# Altium schematic sheet Sheet1.SCHDOC
size 420 x 297 mm; SheetNumber: 2; SheetTotal: 2; DocumentName: Sheet1.SCHDOC
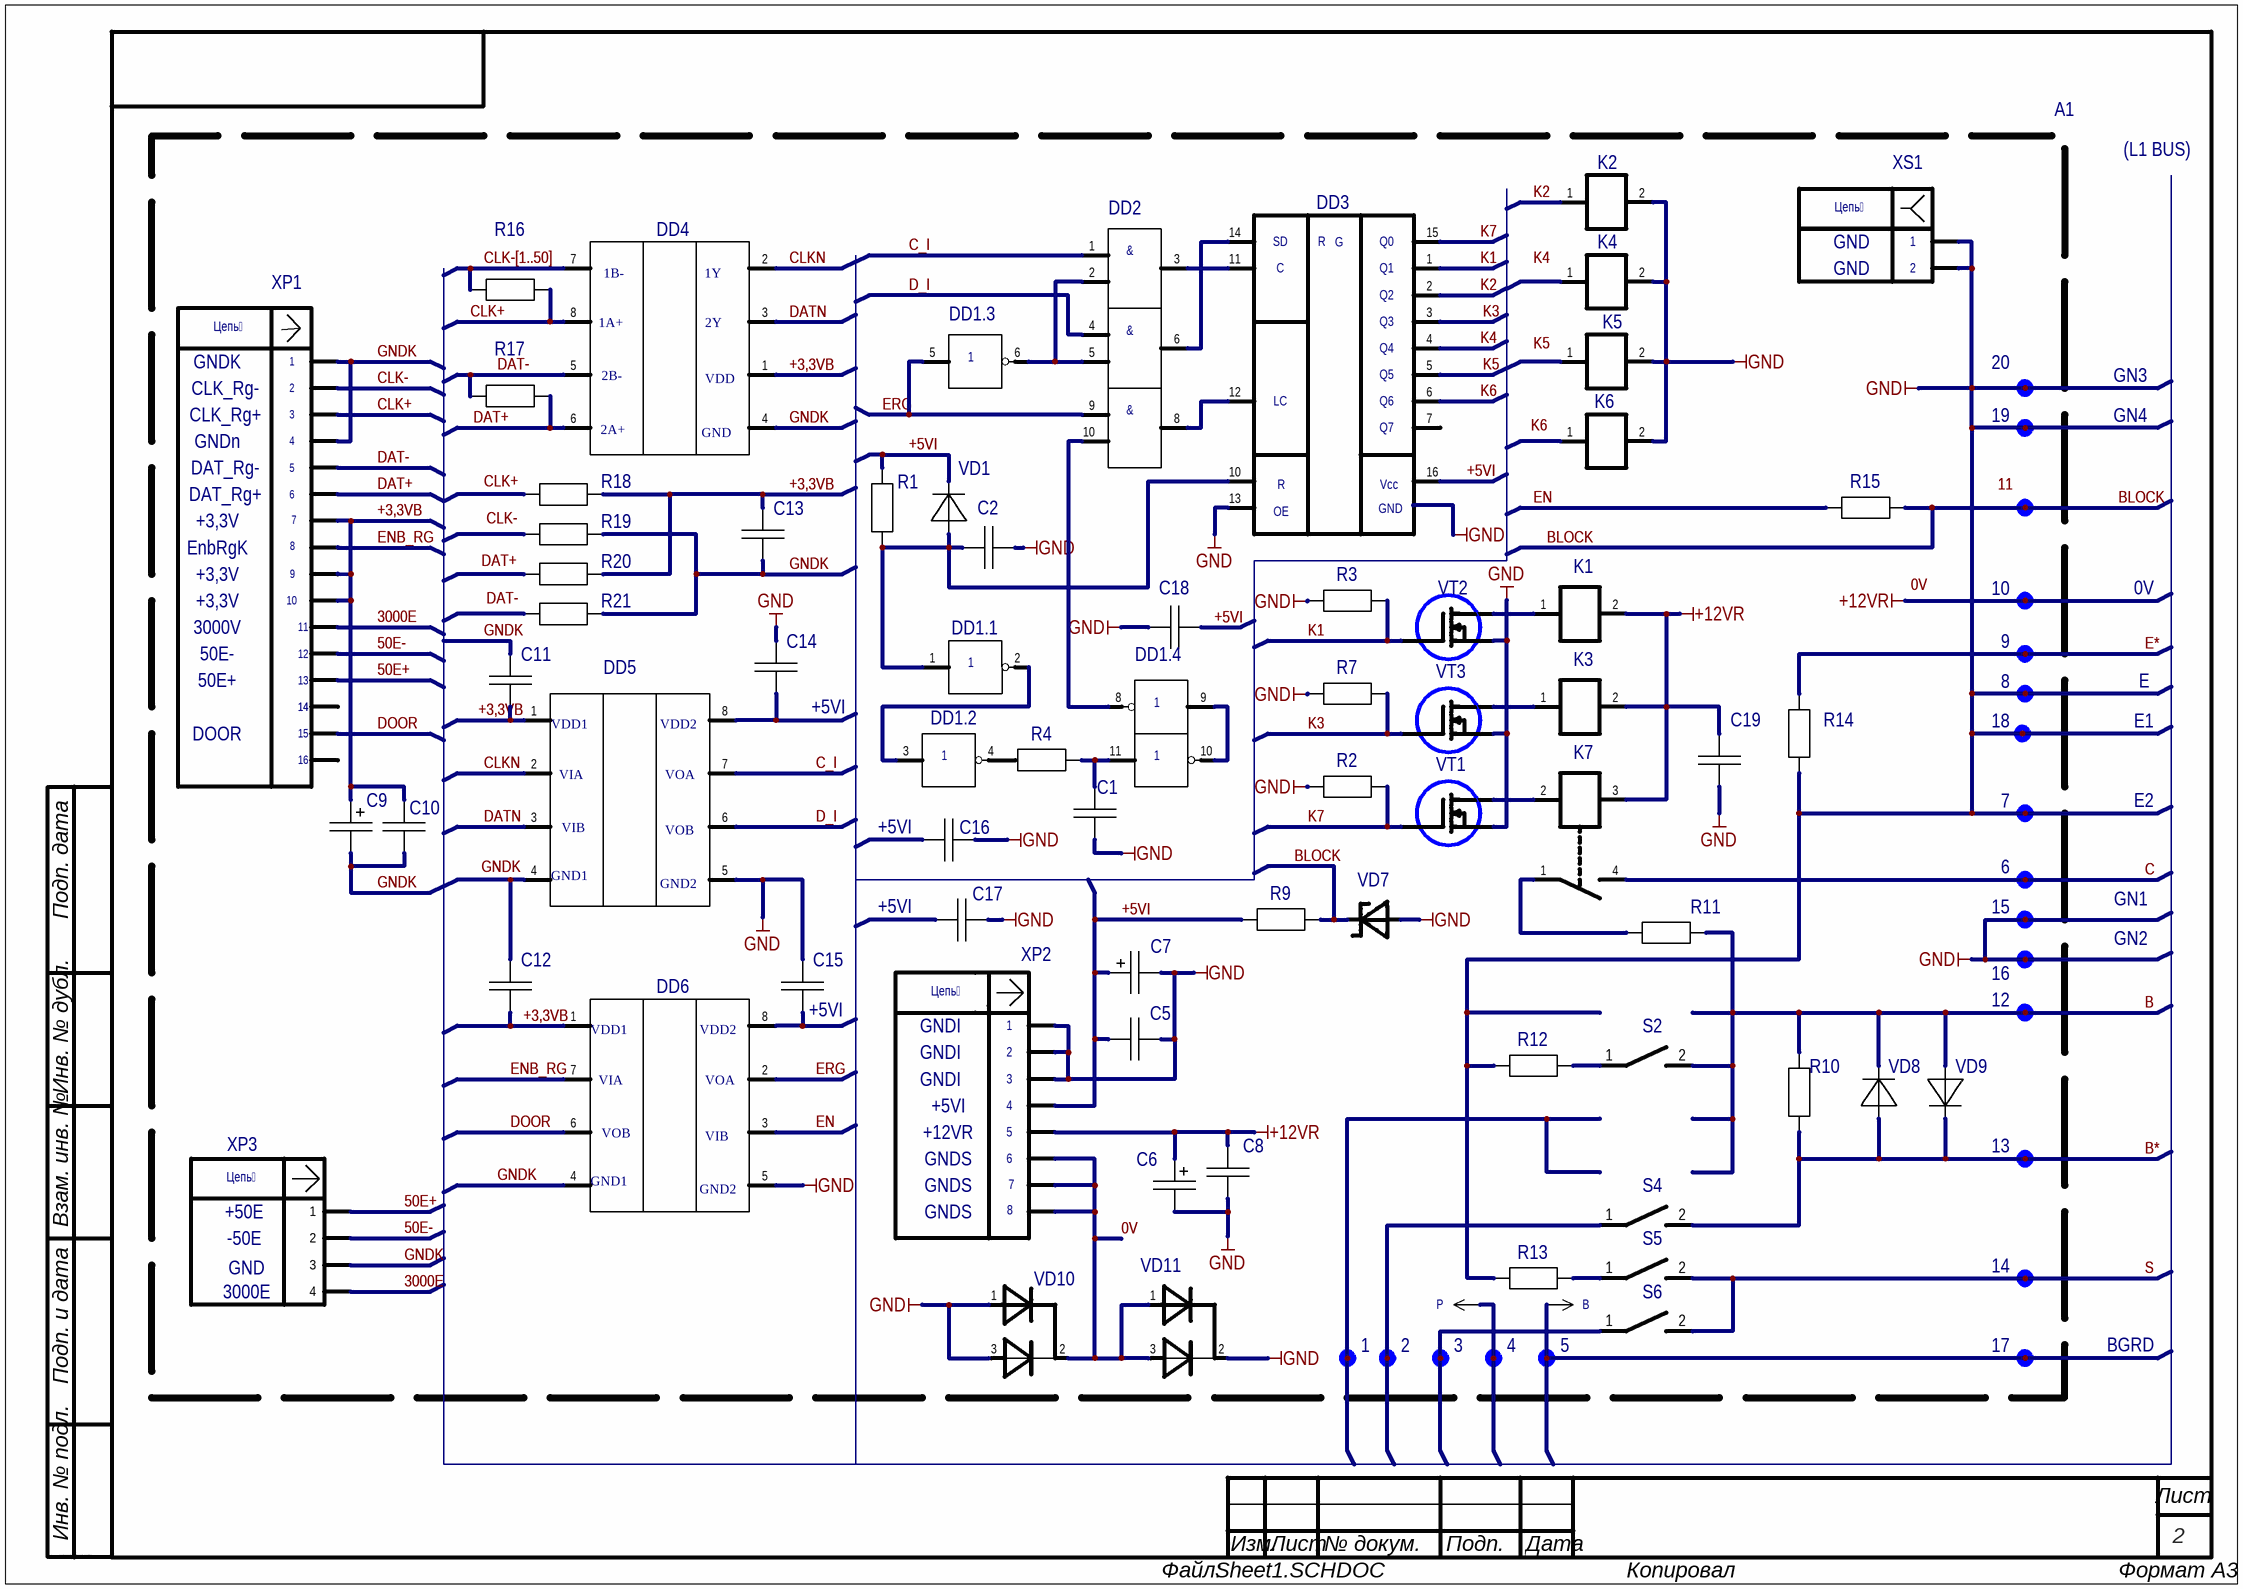
[diagram p0: Sheet1.SCHDOC]

## Parts
1  ТОЧКА ПАЙКИ 1  [LEPESTOK7_750_224]  (value not drawn)
2  ТОЧКА ПАЙКИ 1  [LEPESTOK7_750_224]  (value not drawn)
3  ТОЧКА ПАЙКИ 1  [LEPESTOK7_750_224]  (value not drawn)
4  ТОЧКА ПАЙКИ 1  [LEPESTOK7_750_224]  (value not drawn)
5  ТОЧКА ПАЙКИ 1  [LEPESTOK7_750_224]  (value not drawn)
6  ТОЧКА ПАЙКИ 1  [LEPESTOK7_750_224]  (value not drawn)
7  ТОЧКА ПАЙКИ 1  [LEPESTOK7_750_224]  (value not drawn)
8  ТОЧКА ПАЙКИ 1  [LEPESTOK7_750_224]  (value not drawn)
9  ТОЧКА ПАЙКИ 1  [LEPESTOK7_750_224]  (value not drawn)
10  ТОЧКА ПАЙКИ 1  [LEPESTOK7_750_224]  (value not drawn)
11  ТОЧКА ПАЙКИ 1  [LEPESTOK7_750_224]  (value not drawn)
12  ТОЧКА ПАЙКИ 1  [LEPESTOK7_750_224]  (value not drawn)
13  ТОЧКА ПАЙКИ 1  [LEPESTOK7_750_224]  (value not drawn)
14  ТОЧКА ПАЙКИ 1  [LEPESTOK7_750_224]  (value not drawn)
15  ТОЧКА ПАЙКИ 1  [LEPESTOK7_750_224]  (value not drawn)
16  ТОЧКА ПАЙКИ 1  [LEPESTOK7_750_224]  (value not drawn)
17  ТОЧКА ПАЙКИ 1  [LEPESTOK7_750_224]  (value not drawn)
18  ТОЧКА ПАЙКИ 1  [LEPESTOK7_750_224]  (value not drawn)
19  ТОЧКА ПАЙКИ 1  [LEPESTOK7_750_224]  (value not drawn)
20  ТОЧКА ПАЙКИ 1  [LEPESTOK7_750_224]  (value not drawn)
C1  0805-2F3-0,33 МКФ  [0805]  (value not drawn)
C2  0805-2F3-0,33 МКФ  [0805]  (value not drawn)
C5  0805-2F3-0,33 МКФ  [0805]  (value not drawn)
C6  TAJB685K16RNJ  [TANT_B]  (value not drawn)
C7  TAJB685K16RNJ  [TANT_B]  (value not drawn)
C8  0805-2F3-0,33 МКФ  [0805]  (value not drawn)
C9  TAJB685K16RNJ  [TANT_B]  (value not drawn)
C10  0805-2F3-0,1 МКФ  [0805]  (value not drawn)
C11  0805-2F3-0,1 МКФ  [0805]  (value not drawn)
C12  0805-2F3-0,1 МКФ  [0805]  (value not drawn)
C13  0805-2F3-0,1 МКФ  [0805]  (value not drawn)
C14  0805-2F3-0,1 МКФ  [0805]  (value not drawn)
C15  0805-2F3-0,1 МКФ  [0805]  (value not drawn)
C16  0805-2F3-0,33 МКФ  [0805]  (value not drawn)
C17  0805-2F3-0,33 МКФ  [0805]  (value not drawn)
C18  0805-2F3-0,33 МКФ  [0805]  (value not drawn)
C19  0805-2F3-0,33 МКФ  [0805]  (value not drawn)
DD1.1  IN74HC04-1A  (value not drawn)
DD1.2  IN74HC04  [SO-14]  (value not drawn)  (part B of 6)
DD3  IN74HC595AD-A  (value not drawn)
DD4  SN65LVDS34  (value not drawn)
DD5  ADUM1200AR  (value not drawn)
DD6  ADUM1201AR-C  (value not drawn)
DD7  IN74HC08D  [SO-14]  (value not drawn)  (part C of 4)
DD10  IN74HC08D  [SO-14]  (value not drawn)  (part B of 4)
K1  КАТУШКА УШЯИ.685442.092  (value not drawn)
K2  КАТУШКА УШЯИ.685442.086  (value not drawn)
K3  КАТУШКА УШЯИ.685442.092  (value not drawn)
K4  КАТУШКА УШЯИ.685442.086  (value not drawn)
K5  КАТУШКА УШЯИ.685442.086  (value not drawn)
K6  КАТУШКА УШЯИ.685442.086  (value not drawn)
K7  РЕЛЕ DAT71210  (value not drawn)
R1  0805-51 KОМ+-5%  [0805]  (value not drawn)
R2  0805-1 KОМ+-5%  [0805]  (value not drawn)
R3  0805-1 KОМ+-5%  [0805]  (value not drawn)
R4  0805-51 KОМ+-5%  [0805]  (value not drawn)
R7  0805-1 KОМ+-5%  [0805]  (value not drawn)
R9  1206-22 ОМ+-5%  [1206]  (value not drawn)
R10  С2-33Н-0,25-22 ОМ+-5%-А-Г-В  [C2-33-0,25]  (value not drawn)
R11  С2-33Н-0,5-1 ОМ+-5%-А-Г-В  [C2-33-0,5]  (value not drawn)
R12  С2-33Н-1-1 КОМ+-5%-А-Г-В  [C2-33-1]  (value not drawn)
R13  С2-33Н-0,5-10 ОМ+-5%-А-Г-В  [C2-33-0,5]  (value not drawn)
R14  С2-33Н-0,25-22 ОМ+-5%-А-Г-В  [C2-33-0,25]  (value not drawn)
R15  0805-1 KОМ+-5%  [0805]  (value not drawn)
R16  0805-100 ОМ+-5%  [0805]  (value not drawn)
R17  0805-100 ОМ+-5%  [0805]  (value not drawn)
R18  0805-100 ОМ+-5%  [0805]  (value not drawn)
R19  0805-100 ОМ+-5%  [0805]  (value not drawn)
R20  0805-100 ОМ+-5%  [0805]  (value not drawn)
R21  0805-100 ОМ+-5%  [0805]  (value not drawn)
S2  ГЕРКОН МКА-14103А  (value not drawn)
S4  ГЕРКОН МКА-14103А  (value not drawn)
S5  ГЕРКОН МКА-14103А  (value not drawn)
S6  ГЕРКОН МКА-14103А  (value not drawn)
U1  P
U2  B
U4  IN74HC04-3  (value not drawn)
U5  IN74HC04-4  (value not drawn)
U6  IN74HC08D-1A  (value not drawn)
U7  IN74HC04-6  (value not drawn)
VD1  ДИОД FR307  (value not drawn)
VD7  СУПРЕССОР 1.5KE6.8A  (value not drawn)
VD8  ДИОД FR307  (value not drawn)
VD9  ДИОД FR307  (value not drawn)
VD10  ДИОД VS-43CTQ100  (value not drawn)
VD11  ДИОД VS-43CTQ100  (value not drawn)
VT1  NDS7002A  [SOT-23]  (value not drawn)
VT2  NDS7002A  [SOT-23]  (value not drawn)
VT3  NDS7002A  [SOT-23]  (value not drawn)
XP2  BH-16  [BH-16]  (value not drawn)
XP3  AMP 0-0280371-1  (value not drawn)
XP4  AMPMODU-II 280373-2  (value not drawn)
XS23  РОЗЕТКА  XT-60-F  (value not drawn)

## Nets
+12VR: 10.1 C6.1 C8.2 C19.1 K1.2 K3.2 K7.3 XP4.5
GND: 7.1 8.1 15.1 16.1 18.1 19.1 20.1 C1.2 C2.1 C5.1 C6.2 C7.2 C8.1 C14.2 C15.2 C16.2 C17.2 C18.2 C19.2 DD3.13 DD5.5 DD6.5 K2.2 K4.2 K5.2 K6.2 R2.1 R3.1 R7.1 R12.1 R13.1 R14.1(A) VD7.2(+) VD10.1 VD10.3 VD11.2 VT1.E VT2.E VT3.E XP4.1 XP4.2 XP4.3 XS23.1 XS23.2
0V: VD10.2 VD11.1 VD11.3 XP4.6 XP4.7 XP4.8
50E+: XP2.13 XP3.1
50E-: XP2.12 XP3.2
3000E: XP2.11 XP3.4
+3,3VB: C9.1 C10.2 C11.1 C12.1 C13.2 DD4.1 DD5.1 DD6.1 R18.2 R20.2 XP2.7 XP2.9 XP2.10
+5VI: C5.2 C7.1 C18.1 DD3.16 R1.2 R9.2 VD1.2 XP4.4
B: 12.1 R10.2(A) R11.1 S2.2 VD8.2 VD9.1
B*: 13.1 R10.1(A) S4.2 VD8.1 VD9.2
BLOCK: 11.1 R9.1 R15.2 VD7.1(-)
C: 6.1 K7.4
C_I: DD5.7 U6.1
CLK+: DD4.8 R16.2 XP2.3
CLK-: XP2.2
CLK-[1..50]: DD4.7 R16.1
CLKN: DD4.2 DD5.2
D_I: DD5.6 DD10.4
DAT+: DD4.6 R17.2 XP2.6
DAT-: DD4.5 R17.1 XP2.5
DATN: DD4.3 DD5.3
DOOR: DD6.6 XP2.15
E*: 9.1 R14.2(A)
EN: DD6.3 R15.1
ENB_RG: DD6.7 XP2.8
ERG: DD6.2 DD7.9 U7.5
GNDK: C9.2 C10.1 C11.2 C13.1 DD4.4 DD6.4 R19.2 R21.2 XP2.1 XP2.4 XP3.3
K1: DD3.1(Q1) R3.2 VT2.B
K2: DD3.2(Q2) K2.1
K3: DD3.3(Q4) R7.2 VT3.B
K4: DD3.4(Q4)
K5: DD3.5(Q5)
K6: DD3.6(Q6)
K7: DD3.15(Q0) R2.2 VT1.B
S: 14.1 S5.2 S6.2
Net2_1: 2.1 S4.1
Net3_1: 3.1 S6.1
Net4_1: 4.1 U1.1
Net5_1: 5.1 17.1 U2.1
NetC1_1: C1.1 R4.1 U5.11
NetC2_2: C2.2 DD1.1.1 DD3.10 R1.1 VD1.1
NetC12_2: C12.2 DD5.4
NetC14_1: C14.1 DD5.8
NetC15_1: C15.1 DD6.8
NetDD1.1_2: DD1.1.2 DD1.2.3
NetDD1.2_4: DD1.2.4 R4.2
NetDD3_11: DD3.11(C) U6.3
NetDD3_12: DD3.12(LC) DD7.8
NetDD3_14: DD3.14(SD) DD10.6
NetDD7_10: DD7.10 U4.8
NetDD10_5: DD10.5 U6.2 U7.6
NetK1_1: K1.1 VT2.K
NetK3_1: K3.1 VT3.K
NetK7_1: K7.1 R11.2
NetK7_2: K7.2 VT1.K
NetR12_2: R12.2 S2.1
NetR13_2: R13.2 S5.1
NetU4_9: U4.9 U5.10

Not connected (* = marked no-connect by the designer): 1 1; C16 1; C17 1; DD3 7(Q7); K4 1; K5 1; K6 1; R18 1; R19 1; R20 1; R21 1; XP2 14 16

## Notes on the sheet
- A1
- XS1
- (L1 BUS)
- (near U6) DD2
- GND
- XP1
- (near U7) DD1.3
- GNDK
- (near XP2) CLK_Rg-
- GN3
- GNDn
- (near XP2) DAT_Rg-
- (near XP2) CLK_Rg+
- GN4
- +3,3V
- (near XP2) DAT_Rg+
- EnbRgK
- 0V
- 3000V
- 50E-
- (near C18) DD1.4
- 50E+
- DOOR
- (near C14) +5VI
- DD1.2
- E
- E1
- (near C16) +5VI
- E2
- (near C17) +5VI
- GN1
- (near C15) +5VI
- XP2
- GN2
- GNDI
- +5VI
- (near XP4) +12VR
- +50E
- GNDS
- -50E
- (near XP3) 3000E
- BGRD
- Подп. дата
- Инв. № дубл.
- Взам. инв. №
- Подп. и дата
- Инв. № подл.
- Изм.
- Лист
- № докум.
- Подп.
- Дата
- ALTIUM GOSTBOM2.0 KEV
- Файл:
- Копировал
- Формат А3
- (in symbol ADUM1200AR) VDD1; VDD2; VIA; VOA; VIB; VOB; GND1; GND2
- (in symbol ADUM1201AR-C) VDD1; VDD2; VIA; VOA; VOB; VIB; GND1; GND2
- (in symbol AMP 0-0280371-1) Цепь
- (in symbol AMPMODU-II 280373-2) Цепь
- (in symbol BH-16) Цепь
- (in symbol IN74HC04, part B) 1
- (in symbol IN74HC04-3) 1
- (in symbol IN74HC04-4) 1
- (in symbol IN74HC04-6) 1
- (in symbol IN74HC08D, part B) &
- (in symbol IN74HC08D, part C) &
- (in symbol IN74HC08D-1A) &
- (in symbol IN74HC595AD-A) R; G; Q3; Vcc; OE; GND
- (in symbol SN65LVDS34) 1B-; 1Y; 1A+; 2Y; 2B-; VDD; 2A+; GND
- (in symbol РОЗЕТКА  XT-60-F) Цепь

## Library data of the parts
1-20 = ТОЧКА ПАЙКИ 1: Name: Точка пайки; Value: *
C1 C2 C5 C8 C16-C19 = 0805-2F3-0,33 МКФ: Standart: Murata; Name2: Конденсатор 0805-2F3-0,33 мкФ; Name1: Конденсатор 0805-2F3-0,33 мкФ
C6 C7 C9 = TAJB685K16RNJ: Standart: AVX; Name2: TAJB685K16RNJ; Name1: TAJB685K16RNJ
C10-C15 = 0805-2F3-0,1 МКФ: Name2: GRM21BR71H104KA01L; Value: *; Name1: GRM21BR71H104KA01L
DD7 = IN74HC08D: Name2: Микросхема IN74HC08D; Standart: ТУ РБ 14513714.004-01-95; Value: *; Name1: Микросхема IN74HC08D
K7 = РЕЛЕ DAT71210: Standart: SENTANA/CYNERGY; Name2: Реле DAT71210; Name1: Реле DAT71210
R1 R4 = 0805-51 KОМ+-5%: Name1: Резистор 0805-51 кОм+-5%; Name2: Резистор 0805-51 кОм+-5%
R2 R3 R7 R15 = 0805-1 KОМ+-5%: Value: 1 кОм; Name1: Резистор 0805-1 кОм+-5%; Name2: Резистор 0805-1 кОм+-5%
R9 = 1206-22 ОМ+-5%: Name1: Резистор 1206-22 Ом+-5%; Name2: Резистор 1206-22 Ом+-5%
R10 R14 = С2-33Н-0,25-22 ОМ+-5%-А-Г-В: Value: 22 Ом; Standart: ОЖО.467.173ТУ; Name1: Резистор С2-33Н-0,25-22 Ом+-5%-А-Г-В ОЖО.467.173ТУ; Name2: Резистор С2-33Н-0,25-22 Ом+-5%-А-Г-В
R11 = С2-33Н-0,5-1 ОМ+-5%-А-Г-В: Standart: ОЖО.467.173ТУ; Name2: С2-33Н-0,5-1 Ом+-5%-А-Г-В; Name1: С2-33Н-0,5-1 Ом+-5%-А-Г-В
R12 = С2-33Н-1-1 КОМ+-5%-А-Г-В: Standart: ОЖО.467.173ТУ; Name2: С2-33Н-1-1 КОМ+-5%-А-Г-В; Name1: С2-33Н-1-1 КОМ+-5%-А-Г-В
R13 = С2-33Н-0,5-10 ОМ+-5%-А-Г-В: Standart: ОЖО.467.173ТУ; Name2: С2-33Н-0,5-10 Ом+-5%-А-Г-В; Name1: С2-33Н-0,5-10 Ом+-5%-А-Г-В
R16-R21 = 0805-100 ОМ+-5%: Value: 100 Ом; Name1: Резистор 0805-100 Ом +-5%; Name2: Резистор 0805-100 Ом +-5%
S2 S4-S6 = ГЕРКОН МКА-14103А: Standart: СЯО.360.024 ТУ; Value: *; Name2: Геркон МКА-14103А; Name1: Геркон МКА-14103А
VD7 = СУПРЕССОР 1.5KE6.8A: Standart: VISHAY; Name1: Диод 1N5821; Value: *; Name2: Диод 1N5821
VD8 VD9 = ДИОД FR307: Standart: Philips; Value: *; Name2: Диод FR307; Name1: Диод FR307
VD10 VD11 = ДИОД VS-43CTQ100: Standart: Vishay Semiconductors; Value: *; Name1: Диод VS-43CTQ100; Name2: Диод VS-43CTQ100
VT1-VT3 = NDS7002A: Name2: Транзистор NDS7002A; Standart: FAIRCHILD Semiconductor; Value: *; Name1: Транзистор NDS7002A
XP2 = BH-16: Standart: Белконтмаш; Name2: Вилка BH-16; Name1: Вилка BH-16 Белконтмаш; Value: *
XP3 = AMP 0-0280371-1: Name2: Вилка AMP 0-280371-2; Name1: Вилка AMP 0-280371-2 Tyco Electronics; Value: *
XP4 = AMPMODU-II 280373-2: Standart: Tyco Electronics; Name2: Вилка AMPMODU-II 280373-2; Value: *; Name1: Вилка AMPMODU-II 280373-2
XS23 = РОЗЕТКА  XT-60-F: Standart: Amass Electronics; Value: *; Name2: Розетка  XT-60-F; Name1: Розетка  XT-60-F
DD1.1 = IN74HC04-1A: Value: *
DD1.2 = IN74HC04: Value: *
DD3 = IN74HC595AD-A: Value: *
DD4 = SN65LVDS34: Value: *
DD5 = ADUM1200AR: Value: *
DD6 = ADUM1201AR-C: Value: *
DD10 = IN74HC08D: Value: *
K1 K3 = КАТУШКА УШЯИ.685442.092: Value: *; Name2: Катушка УШЯИ.685442.092; Name1: Катушка УШЯИ.685442.092; Standart: УШЯИ.685442.092
K2 K4-K6 = КАТУШКА УШЯИ.685442.086: Value: *; Name2: Катушка УШЯИ.685442.086; Name1: Катушка УШЯИ.685442.086; Standart: УШЯИ.685442.086
U1 = P: Value: *
U2 = B: Value: *
U4 = IN74HC04-3: Value: *
U5 = IN74HC04-4: Value: *
U6 = IN74HC08D-1A: Value: *
U7 = IN74HC04-6: Value: *
VD1 = ДИОД FR307: Value: *